# Altium schematic sheet Triangular_Wave.SchDoc
size A; SheetNumber: 5; SheetTotal: 6
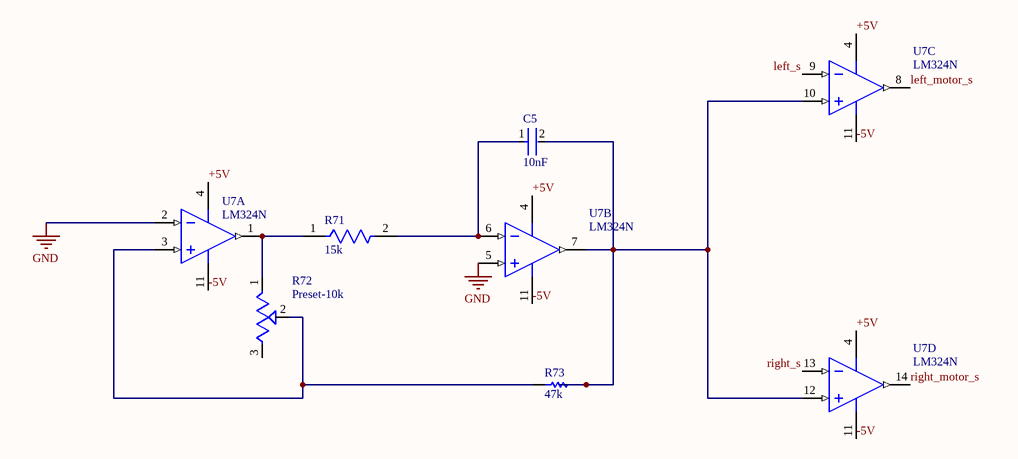
[diagram p0: Triangular_Wave.SchDoc]

## Parts
C5  10nF  [FP-C0805C-DN-MFG]
R71  15k  [FP-CRCW0805-e3-IPC_C]
R72  Preset-10k  [TRIM_3306F-1-103]
R73  47k  [RESC2013X60X35NL10T20]
U7  LM324N  [N0014A]  (parts A,B,C,D of 4)

## Nets
GND: U7.2(IN1-) U7.5(IN2+)
+5V: U7.4(V+)
-5V: U7.11(GND)
left_motor_s: U7.8(OUT3)
left_s: U7.9(IN3-)
right_motor_s: U7.14(OUT4)
right_s: U7.13(IN4-)
NetC5_1: C5.1 R71.2 U7.6(IN2-)
NetC5_2: C5.2 R73.2 U7.7(OUT2) U7.10(IN3+) U7.12(IN4+)
NetR71_1: R71.1 R72.1(CCW) U7.1(OUT1)
NetR72_2: R72.2(W) R73.1 U7.3(IN1+)

Not connected (* = marked no-connect by the designer): R72 3(CW)

## Library data of the parts
C5 = 10nF: CAP CER 10000PF 50V X7R 0805; C0805C103K5RACTU; Manufacturer: KEMET; Capacitance: 10,000 pF; Material: Ceramic; Tolerance: 0.1; Value: 10,000 pF; Temperature Coefficient: 30ppm/°C; Temperature: -55°C to +125°C; Device Class L3: Ceramic Capacitors; ComponentLink2URL: https://content.kemet.com/datasheets/KEM_C1003_C0G_SMD.pdf; Temperature Range Low: -55°C; Manufacturer Part Number: C0805C103K5RACTU; Ipc Land Pattern Name: CAPC200125X78; Height: 0.88mm; Temperature Range High: +125°C; Category: Cap; ComponentLink2Description: Datasheet; Octopart: https://octopart.com/c0805c103k5ractu-kemet-90536; Package: C0805C-DN; Device Class L2: Capacitors; Voltage Rating: 50 V; RoHS: TRUE; Automotive: No; Digikey Description: CAP CER 10000PF 50V X7R 0805; Temperature Characteristic: X7R; Device Class L1: Passive Components; Lead Free: Yes
R71 = 15k: RES Thick Film, 15kΩ, 1%, 0.125W, 100ppm/°C, 0805; CRCW080515K0FKEA; Power Rating: 125mW; Voltage Rating: 150V; Resistance: 15kR; Height: 0.45mm; Number of Terminations: 2; Composition: Thick Film; Length: 2mm; Case/Package: 0805; Depth: 1.25mm; Min Operating Temperature: -55°C; Lead Free: Lead Free; Mount: Surface Mount; Package Quantity: 10; Termination: SMD/SMT; Packaging: Tape and Reel; Case Code (Metric): 2012; Features: Automotive AEC-Q200; Military Standard: Not; Width: 0.049inch; Temperature Coefficient: 100ppm/°C; Max Power Dissipation: 125mW; Weight: 0.000194oz; Tolerance: 1%; Voltage Rating (DC): 150V; Max Operating Temperature: 155°C; Radiation Hardening: No; Contact Plating: Tin; Case Code (Imperial): 0805
R72 = Preset: TRIMMER - 6MM ROUND, SINGLE-TURN,CERMET, 10K OHMS | Bourns 3306F-1-103; SnapEDA_Link: https://www.snapeda.com/parts/3306F-1-103/Bourns/view-part/?ref=snap; Package: 3306F Bourns; Value: *; MF: Bourns; MP: 3306F-1-103; Check_prices: https://www.snapeda.com/parts/3306F-1-103/Bourns/view-part/?ref=eda
R73 = 47k: Chip Resistor, 47 KOhm, +/- 1%, 0.125 W, -55 to 155 degC, 0805 (2012 Metric), RoHS, Tape and Reel; RC0805FR-0747KL; Manufacturer: Yageo; Voltage Rating: 150 V; Height: 0.5 mm; ComponentLink2URL: http://www.yageo.com/documents/recent/PYu-RC_Group_51_RoHS_L_04.pdf; ComponentLink2Description: Datasheet; Package Quantity: 200; Max Operating Temperature: 155 degC; Min Operating Temperature: -55 degC; Packaging: Tape and Reel; Pins: 2; PackageReference: 0805; Mounting Technology: Surface Mount; ComponentLink1Description: Manufacturer URL; ComponentLink1URL: http://www.yageo.com/; PackageDescription: 2-Pin Surface Mounted Device, Body 2 x 1.25 mm; Length: 2 mm; REACH SVHC: No SVHC; Mount: Surface Mount; RoHSCompliant: true; DatasheetVersion: Rev. 4, 02/2016
U7 = LM324N: Low Power Quad Operational Amplifier, 14-pin MDIP; Manufacturer: Texas Instruments; CompType: Amplifiers; PowerWise: N; PackageTopMarking: NSUZXYYTTE#*LM324N; PackageDescription: MDIP, .750 x .250 x.130in, 14 Lead, .100in Pitch; Package Reference: N0014A; RoHS: N; Code_JEDEC: MS-001-AA; ComponentLink1URL: http://www.ti.com/general/docs/lit/getliterature.tsp?genericPartNumber=LM324&fileType=pdf; ComponentLink1Description: Datasheet URL; PinCount: 14